# Altium project FuelCellMonitor.PrjPcb
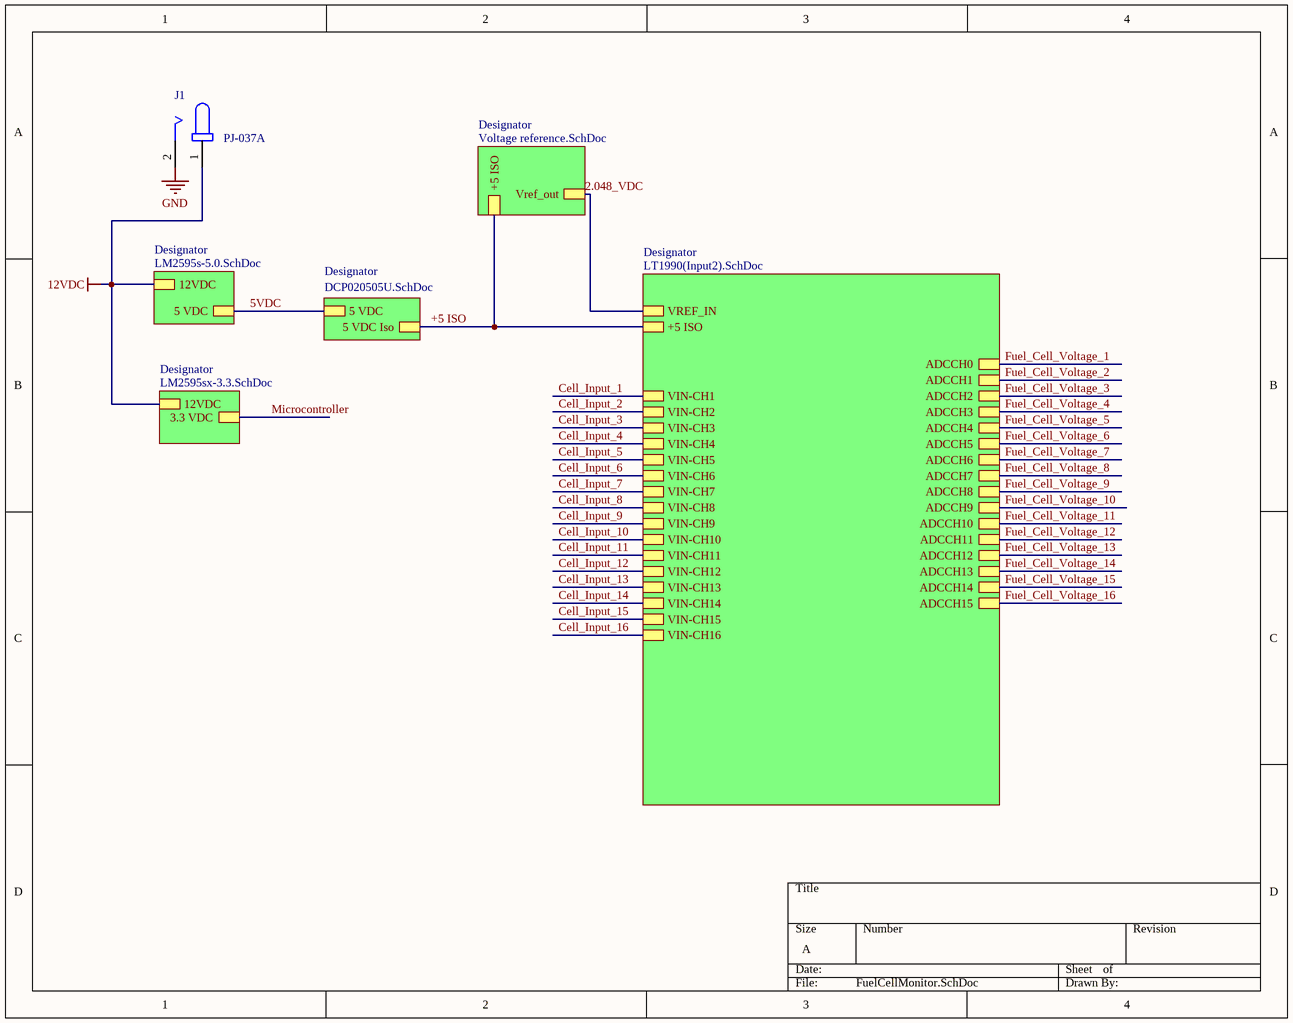
[diagram p0: FuelCellMonitor.SchDoc]
6 sheets, 108 parts. Net scope: hierarchical (ports join the sheet entries above them; power ports are global).
Board file: FuelCellMonitor.PcbDoc
Sheets:
  FuelCellMonitor.SchDoc
    Designator = LM2595s-5.0.SchDoc
    Designator = LM2595sx-3.3.SchDoc
    Designator = DCP020505U.SchDoc
    Designator = Voltage reference.SchDoc
    Designator = LT1990(Input2).SchDoc

## Sheet FuelCellMonitor.SchDoc
size A; SheetNumber: 1; SheetTotal: 6

### Parts
J1  PJ-037A  [CUI_PJ-037A]

### Sub-sheets
Designator = LM2595s-5.0.SchDoc: 12VDC, 5 VDC
Designator = LM2595sx-3.3.SchDoc: 12VDC, 3.3 VDC
Designator = DCP020505U.SchDoc: 5 VDC, 5 VDC Iso
Designator = Voltage reference.SchDoc: Vref_out, +5 ISO
Designator = LT1990(Input2).SchDoc: ADCCH1, ADCCH2, ADCCH3, ADCCH4, ADCCH5, ADCCH6, ADCCH7, ADCCH8, ADCCH9, ADCCH10, ADCCH11, ADCCH12, ADCCH13, ADCCH14, ADCCH15, ADCCH0, VIN-CH3, VIN-CH4, VIN-CH5, VIN-CH6, VIN-CH8, VIN-CH9, VIN-CH10, VIN-CH11, VIN-CH12, VIN-CH13, VIN-CH14, VIN-CH15, VIN-CH16, VIN-CH2, VIN-CH1, VIN-CH7, VREF_IN, +5 ISO

### Nets
12VDC: J1.1 ; sheet Designator/12VDC, sheet Designator/12VDC
+5 ISO: sheet Designator/5 VDC Iso, sheet Designator/+5 ISO, sheet Designator/+5 ISO
GND: J1.2
2.048_VDC: sheet Designator/Vref_out, sheet Designator/VREF_IN
5VDC: sheet Designator/5 VDC, sheet Designator/5 VDC

### Library data of the parts
J1 = PJ-037A: 2.0 mm Center Pin, 2.5 A, Right Angle, Through Hole, Dc Power Jack Connector; Value: *; Price: None; MP: PJ-037A; Availability: Unavailable; Package: None

## Sheet LM2595s-5.0.SchDoc
size A; SheetNumber: 2; SheetTotal: 6; SPICEModelCacheCJDLJAOA: <root> / <DocumentId>CJDLJAOA</DocumentId> / </root>
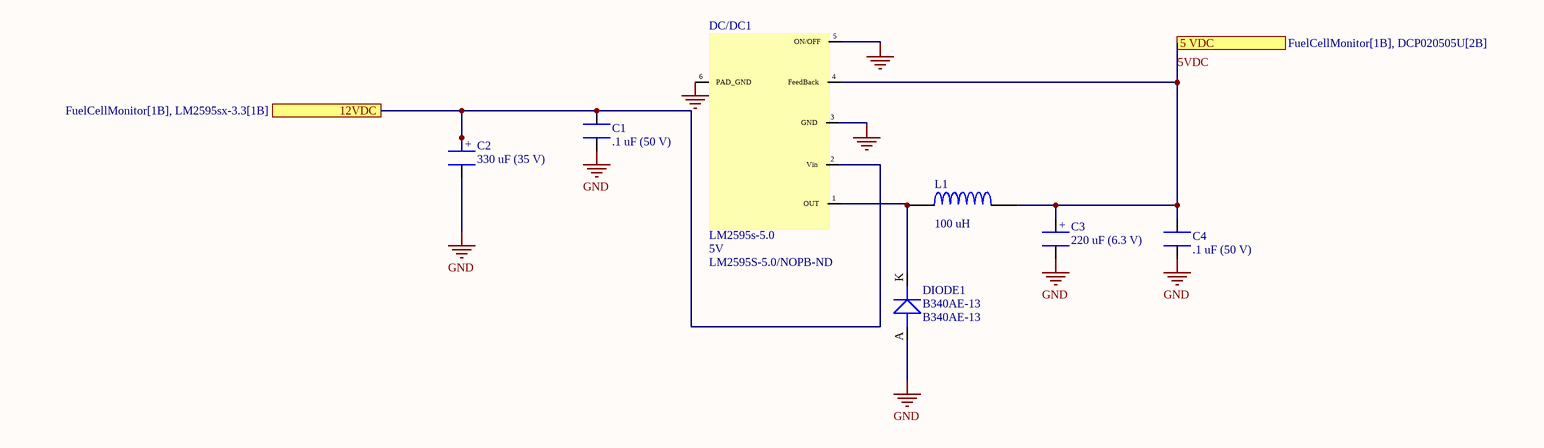
[diagram p1: LM2595s-5.0.SchDoc]

### Parts
C1  .1 uF (50 V)  [.1uF capacitor]
C2  330 uF (35 V)  [330uf cap]
C3  220 uF (6.3 V)  [220 uf cap]
C4  .1 uF (50 V)  [.1uF capacitor]
DC/DC1  LM2595s-5.0  Output Voltage: 5V  Supplier Part Number 1: LM2595S-5.0/NOPB-ND  [LM2595s-5.0]
DIODE1  B340AE-13  [B340AE-13]
L1  100 uH  [100uH inductor]

### Ports
5 VDC (see FuelCellMonitor[1B], DCP020505U[2B]), 12VDC (see FuelCellMonitor[1B], LM2595sx-3.3[1B])

### Nets
12VDC: C1.2 C2.1 DC/DC1.2(Vin) ; port 12VDC
GND: C1.1 C2.2 C3.2 C4.1 DC/DC1.3(GND) DC/DC1.5(ON/OFF) DC/DC1.6(PAD_GND) DIODE1.A
5VDC: C3.1 C4.2 DC/DC1.4(FeedBack) L1.2 ; port 5 VDC
NetDC/DC1_1: DC/DC1.1(OUT) DIODE1.K L1.1

### Notes on the sheet
- (in symbol 220 uF capacitor) +
- (in symbol 330 uF cap) +

### Library data of the parts
C1 C4 = .1 uF cap
C2 = 330 uF cap
C3 = 220 uF capacitor
DC/DC1 = LM2595S-5.0/NOPB: SIMPLE SWITCHE Power Converter 150 KHz 1A Step-Down Voltage egulator 5-DDPAK/TO-263; Manufacturer: Texas Instruments; Number of Outputs: 1; Efficiency: 82%; Min Input Voltage: 4.5V; Max Input Voltage: 40V; Frequency: 150kHz; Switching Frequency: 173kHz; Quiescent Current: 5mA; Output Type: Fixed; Supplier 1: Digi-Key; Manufacturer Part Number: LM2595S-5.0/NOPB; RoHS: Yes; Category: Voltage Regulators - Switching; Mount: Surface Mount; Case/Package: TO-263; Number of Pins: 5; Weight: 0.25lb; Min Operating Temperature: -40°C; Max Operating Temperature: 125°C; Output Current: 1A; Package Quantity: 45; Packaging: Rail/Tube; Max Output Current: 1A; Max Supply Voltage: 40V; Min Supply Voltage: 4.5V; Nominal Output Voltage: 5V; Max Output Voltage: 5V; Termination: SMD/SMT; Length: 10.16mm; Width: 8.64mm; Height: 4.57mm; Radiation Hardening: No; Lead Free: Contains Lead; RoHS Compliant: Yes; REACH SVHC: No SVHC; ComponentLink1URL: https://datasheet.ciiva.com/14150/eanatsemico-schaltr-lm2595-en-14150687.pdf?src-supplier=Distrelec; ComponentLink1Description: https://datasheet.ciiva.com/14150/eanatsemico-schaltr-lm2595-en-14150687.pdf?src-supplier=Distrelec; ComponentLink2URL: https://datasheet.ciiva.com/15112/getdatasheetpartid-89913-15112836.pdf?src-supplier=Verical; ComponentLink2Description: https://datasheet.ciiva.com/15112/getdatasheetpartid-89913-15112836.pdf?src-supplier=Verical; ComponentLink3URL: https://datasheet.ciiva.com/25775/1771567-25775403.pdf?src-supplier=Farnell; ComponentLink3Description: https://datasheet.ciiva.com/25775/1771567-25775403.pdf?src-supplier=Farnell; ComponentLink4URL: https://datasheet.ciiva.com/22746/1771567-22746709.pdf?src-supplier=Element14; ComponentLink4Description: https://datasheet.ciiva.com/22746/1771567-22746709.pdf?src-supplier=Element14; ComponentLink5URL: https://datasheet.ciiva.com/3219/lm2595-3219977.pdf?src-supplier=Avnet; ComponentLink5Description: https://datasheet.ciiva.com/3219/lm2595-3219977.pdf?src-supplier=Avnet
DIODE1 = B340AE-13: Schottky Diode, DO-201, 40V, 3.00A; Manufacturer: STMicroelectronics; Max Surge Current: 80A; Average Rectified Current: 3A; Max Reverse Leakage Current: 2mA; Element Configuration: Single; Polarity: Standard; Forward Voltage: 950mV; Capacitance: 190pF; Supplier 1: Mouser; RoHS: Yes; Category: Rectifier Diodes; Stock 1: 125419; Pricing 1: 1=0.47000, 10=0.38600, 50=0.38600, 100=0.26300, 600=0.19700, 1000=0.19700, 1200=0.14700, 2400=0.12700, 9600=0.11900, 10000=0.11900 (USD); Mount: Through Hole; Case/Package: DO-201AD; Number of Pins: 2; Weight: 0.01lb; Min Operating Temperature: -65°C; Max Operating Temperature: 150°C; Package Quantity: 1; Packaging: Tape and Reel; Max Forward Surge Current (Ifsm): 80A; Voltage Rating (DC): 40V; Current Rating: 3A; Output Current: 3A; Max Reverse Voltage (DC): 40V; Series: -; Forward Current: 3A; Max Reverse Current: 2mA; Max Repetitive Reverse Voltage (Vrrm): 40V; Peak Non-Repetitive Surge Current: 80A; Length: 9.5mm; Width: 5.3mm; Height: 5.3mm; Radiation Hardening: No; Lead Free: Lead Free; RoHS Compliant: Yes; REACH SVHC: No SVHC; ComponentLink1URL: https://datasheet.ciiva.com/1177/1689683-1177129.pdf?src-supplier=Element14; ComponentLink1Description: https://datasheet.ciiva.com/1177/1689683-1177129.pdf?src-supplier=Element14; ComponentLink2URL: https://datasheet.ciiva.com/26339/168275-da-01-en-schottky-barrier-rectif-axial-1n5822-26339005.pdf?src-supplier=Conrad; ComponentLink2Description: https://datasheet.ciiva.com/26339/168275-da-01-en-schottky-barrier-rectif-axial-1n5822-26339005.pdf?src-supplier=Conrad; ComponentLink3URL: https://datasheet.ciiva.com/16303/cd00001626-16303311.pdf?src-supplier=Future+Electronics; ComponentLink3Description: https://datasheet.ciiva.com/16303/cd00001626-16303311.pdf?src-supplier=Future+Electronics; ComponentLink4URL: https://datasheet.ciiva.com/916/cd00001626-916051.pdf?src-supplier=Digi-Key; ComponentLink4Description: https://datasheet.ciiva.com/916/cd00001626-916051.pdf?src-supplier=Digi-Key; ComponentLink5URL: https://datasheet.ciiva.com/916/cd00001626-916050.pdf?src-supplier=Digi-Key; ComponentLink5Description: https://datasheet.ciiva.com/916/cd00001626-916050.pdf?src-supplier=Digi-Key; Supplier Part Number 1: 511-1N5822; Manufacturer Part Number: B340AE-13
L1 = 100 uH inductor

## Sheet LM2595sx-3.3.SchDoc
size A; SheetNumber: 3; SheetTotal: 6
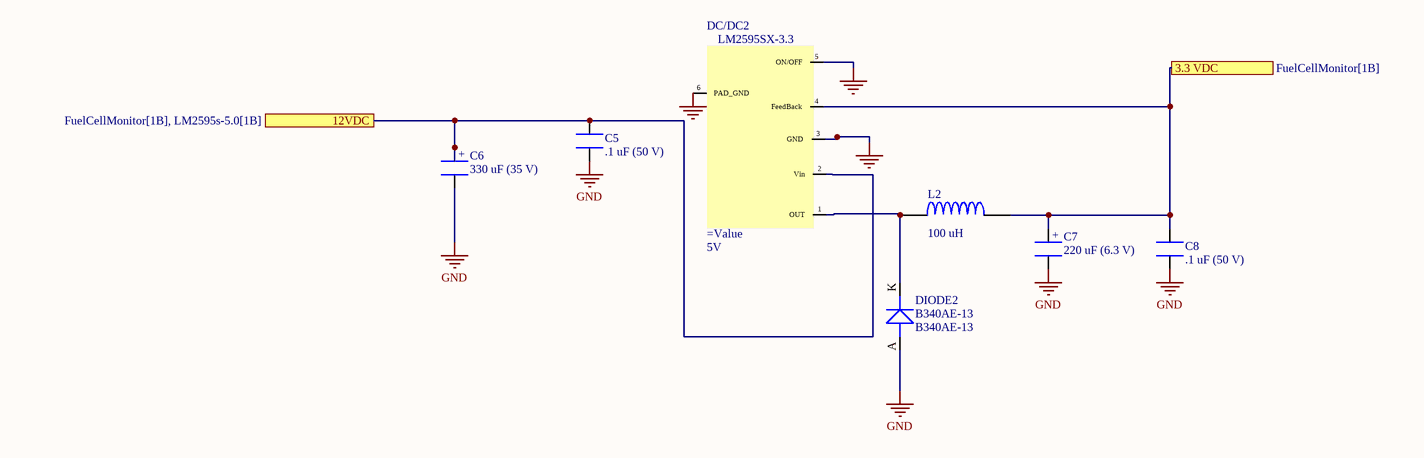
[diagram p2: LM2595sx-3.3.SchDoc]

### Parts
C5  .1 uF (50 V)  [.1uF capacitor]
C6  330 uF (35 V)  [330uf cap]
C7  220 uF (6.3 V)  [220 uf cap]
C8  .1 uF (50 V)  [.1uF capacitor]
DC/DC2  Output Voltage: 5V  [LM2595s-3.3]
DIODE2  B340AE-13  [B340AE-13]
L2  100 uH  [100uH inductor]

### Ports
3.3 VDC (see FuelCellMonitor[1B]), 12VDC (see FuelCellMonitor[1B], LM2595s-5.0[1B])

### Nets
12VDC: C5.2 C6.1 DC/DC2.2(Vin) ; port 12VDC
GND: C5.1 C6.2 C7.2 C8.1 DC/DC2.3(GND) DC/DC2.5(ON/OFF) DC/DC2.6(PAD_GND) DIODE2.A
Microcontroller: C7.1 C8.2 DC/DC2.4(FeedBack) L2.2 ; port 3.3 VDC
NetDC/DC2_1: DC/DC2.1(OUT) DIODE2.K L2.1

### Notes on the sheet
- (in symbol 220 uF capacitor) +
- (in symbol 330 uF cap) +
- (in symbol LM2595SX-3.3/NOPB_1) LM2595SX-3.3

### Library data of the parts
C5 C8 = .1 uF cap
C6 = 330 uF cap
C7 = 220 uF capacitor
DC/DC2 = LM2595SX-3.3/NOPB_1: SIMPLE SWITCHE Power Converter 150 KHz 1A Step-Down Voltage egulator 5-DDPAK/TO-263; Manufacturer: Texas Instruments; Manufacturer Part Number: LM2595S-5.0/NOPB; Number of Outputs: 1; Efficiency: 82%; Min Input Voltage: 4.5V; Max Input Voltage: 40V; Frequency: 150kHz; Switching Frequency: 173kHz; Quiescent Current: 5mA; Output Type: Fixed; Supplier 1: Digi-Key; RoHS: Yes; Category: Voltage Regulators - Switching; Mount: Surface Mount; Case/Package: TO-263; Number of Pins: 5; Weight: 0.25lb; Min Operating Temperature: -40°C; Max Operating Temperature: 125°C; Output Current: 1A; Package Quantity: 45; Packaging: Rail/Tube; Max Output Current: 1A; Max Supply Voltage: 40V; Min Supply Voltage: 4.5V; Nominal Output Voltage: 5V; Max Output Voltage: 5V; Termination: SMD/SMT; Length: 10.16mm; Width: 8.64mm; Height: 4.57mm; Radiation Hardening: No; Lead Free: Contains Lead; RoHS Compliant: Yes; REACH SVHC: No SVHC; ComponentLink1URL: https://datasheet.ciiva.com/14150/eanatsemico-schaltr-lm2595-en-14150687.pdf?src-supplier=Distrelec; ComponentLink1Description: https://datasheet.ciiva.com/14150/eanatsemico-schaltr-lm2595-en-14150687.pdf?src-supplier=Distrelec; ComponentLink2URL: https://datasheet.ciiva.com/15112/getdatasheetpartid-89913-15112836.pdf?src-supplier=Verical; ComponentLink2Description: https://datasheet.ciiva.com/15112/getdatasheetpartid-89913-15112836.pdf?src-supplier=Verical; ComponentLink3URL: https://datasheet.ciiva.com/25775/1771567-25775403.pdf?src-supplier=Farnell; ComponentLink3Description: https://datasheet.ciiva.com/25775/1771567-25775403.pdf?src-supplier=Farnell; ComponentLink4URL: https://datasheet.ciiva.com/22746/1771567-22746709.pdf?src-supplier=Element14; ComponentLink4Description: https://datasheet.ciiva.com/22746/1771567-22746709.pdf?src-supplier=Element14; ComponentLink5URL: https://datasheet.ciiva.com/3219/lm2595-3219977.pdf?src-supplier=Avnet; ComponentLink5Description: https://datasheet.ciiva.com/3219/lm2595-3219977.pdf?src-supplier=Avnet
DIODE2 = B340AE-13: as DIODE1 on sheet LM2595s-5.0; Supplier 1: Mouser; RoHS: Yes; Category: Rectifier Diodes; Stock 1: 125419; Pricing 1: 1=0.47000, 10=0.38600, 50=0.38600, 100=0.26300, 600=0.19700, 1000=0.19700, 1200=0.14700, 2400=0.12700, 9600=0.11900, 10000=0.11900 (USD); Mount: Through Hole; Case/Package: DO-201AD; Number of Pins: 2; Weight: 0.01lb; Min Operating Temperature: -65°C; Max Operating Temperature: 150°C; Package Quantity: 1; Packaging: Tape and Reel; Max Forward Surge Current (Ifsm): 80A; Voltage Rating (DC): 40V; Current Rating: 3A; Output Current: 3A; Max Reverse Voltage (DC): 40V; Series: -; Forward Current: 3A; Max Reverse Current: 2mA; Max Repetitive Reverse Voltage (Vrrm): 40V; Peak Non-Repetitive Surge Current: 80A; Length: 9.5mm; Width: 5.3mm; Height: 5.3mm; Radiation Hardening: No; Lead Free: Lead Free; RoHS Compliant: Yes; REACH SVHC: No SVHC; ComponentLink1URL: https://datasheet.ciiva.com/1177/1689683-1177129.pdf?src-supplier=Element14; ComponentLink1Description: https://datasheet.ciiva.com/1177/1689683-1177129.pdf?src-supplier=Element14; ComponentLink2URL: https://datasheet.ciiva.com/26339/168275-da-01-en-schottky-barrier-rectif-axial-1n5822-26339005.pdf?src-supplier=Conrad; ComponentLink2Description: https://datasheet.ciiva.com/26339/168275-da-01-en-schottky-barrier-rectif-axial-1n5822-26339005.pdf?src-supplier=Conrad; ComponentLink3URL: https://datasheet.ciiva.com/16303/cd00001626-16303311.pdf?src-supplier=Future+Electronics; ComponentLink3Description: https://datasheet.ciiva.com/16303/cd00001626-16303311.pdf?src-supplier=Future+Electronics; ComponentLink4URL: https://datasheet.ciiva.com/916/cd00001626-916051.pdf?src-supplier=Digi-Key; ComponentLink4Description: https://datasheet.ciiva.com/916/cd00001626-916051.pdf?src-supplier=Digi-Key; ComponentLink5URL: https://datasheet.ciiva.com/916/cd00001626-916050.pdf?src-supplier=Digi-Key; ComponentLink5Description: https://datasheet.ciiva.com/916/cd00001626-916050.pdf?src-supplier=Digi-Key; Supplier Part Number 1: 511-1N5822; Manufacturer Part Number: B340AE-13
L2 = 100 uH inductor

## Sheet DCP020505U.SchDoc
size A; SheetNumber: 4; SheetTotal: 6
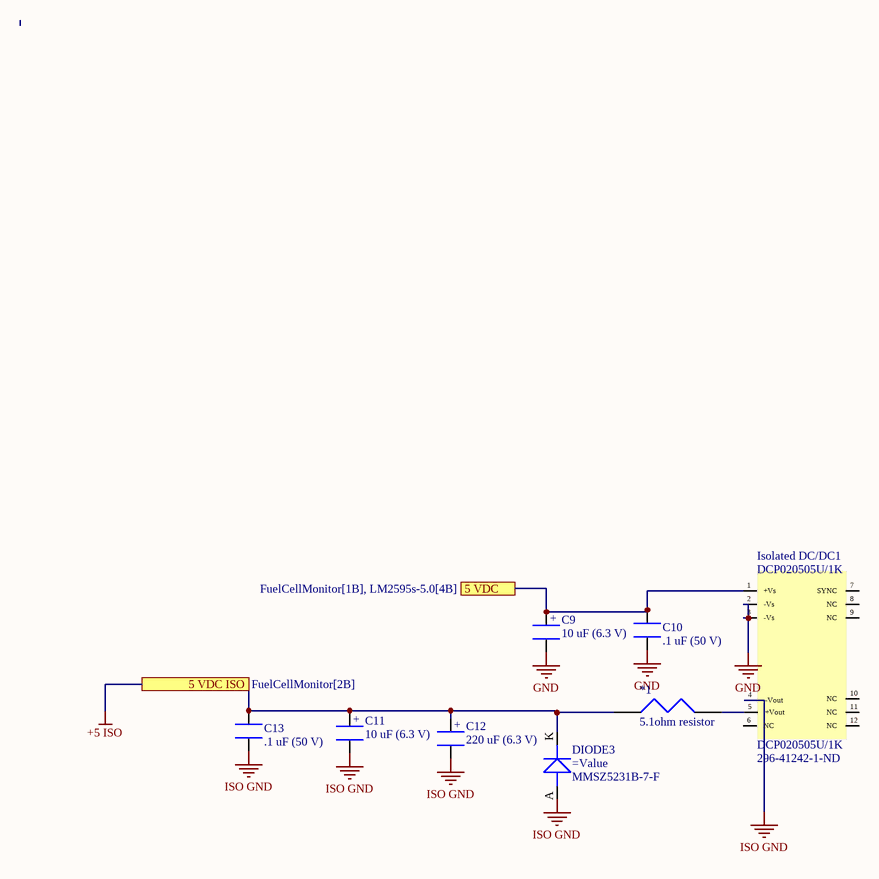
[diagram p3: DCP020505U.SchDoc]

### Parts
*1  5.1ohm resistor  [5.1 ohm resistor]
C9  10 uF (6.3 V)  [10 uF cap]
C10  .1 uF (50 V)  [.1uF capacitor]
C11  10 uF (6.3 V)  [10 uF cap]
C12  220 uF (6.3 V)  [220 uf cap]
C13  .1 uF (50 V)  [.1uF capacitor]
DIODE3  (no value)  [MMSZ5231B-7-F Zener diode]
Isolated_DC/DC1  DCP020505U/1K  Supplier Part Number 1: 296-41242-1-ND  [DCP020505U - duplicate]

### Ports
5 VDC (see FuelCellMonitor[1B], LM2595s-5.0[4B]), 5 VDC ISO (see FuelCellMonitor[2B])

### Nets
+5 ISO: *1.1 C11.1 C12.1 C13.2 DIODE3.K ; port 5 VDC ISO
GND: C9.2 C10.1 Isolated_DC/DC1.2(-Vs) Isolated_DC/DC1.3(-Vs)
ISO GND: C11.2 C12.2 C13.1 DIODE3.A Isolated_DC/DC1.4(-Vout)
5VDC: C9.1 C10.2 Isolated_DC/DC1.1(+Vs) ; port 5 VDC
Net*1_2: *1.2 Isolated_DC/DC1.5(+Vout)

Not connected (* = marked no-connect by the designer): Isolated_DC/DC1 6(NC) 7(SYNC) 8(NC) 9(NC) 10(NC) 11(NC) 12(NC)

### Notes on the sheet
- (in symbol 10 uF cap) +
- (in symbol 220 uF capacitor) +

### Library data of the parts
C9 C11 = 10 uF cap
C10 C13 = .1 uF cap
C12 = 220 uF capacitor
DIODE3 = MMSZ5231B-7-F: Zener diode; Manufacturer: STMicroelectronics; Max Surge Current: 80A; Average Rectified Current: 3A; Max Reverse Leakage Current: 2mA; Element Configuration: Single; Polarity: Standard; Voltage Rating (DC): 40V; Forward Voltage: 950mV; Capacitance: 190pF; Supplier 1: Mouser; RoHS: Yes; Category: Rectifier Diodes; Stock 1: 125419; Pricing 1: 1=0.47000, 10=0.38600, 50=0.38600, 100=0.26300, 600=0.19700, 1000=0.19700, 1200=0.14700, 2400=0.12700, 9600=0.11900, 10000=0.11900 (USD); Mount: Through Hole; Case/Package: DO-201AD; Number of Pins: 2; Weight: 0.01lb; Min Operating Temperature: -65°C; Max Operating Temperature: 150°C; Package Quantity: 1; Packaging: Tape and Reel; Max Forward Surge Current (Ifsm): 80A; Current Rating: 3A; Output Current: 3A; Max Reverse Voltage (DC): 40V; Series: -; Forward Current: 3A; Max Reverse Current: 2mA; Max Repetitive Reverse Voltage (Vrrm): 40V; Peak Non-Repetitive Surge Current: 80A; Length: 9.5mm; Width: 5.3mm; Height: 5.3mm; Radiation Hardening: No; Lead Free: Lead Free; RoHS Compliant: Yes; REACH SVHC: No SVHC; ComponentLink1URL: https://datasheet.ciiva.com/1177/1689683-1177129.pdf?src-supplier=Element14; ComponentLink1Description: https://datasheet.ciiva.com/1177/1689683-1177129.pdf?src-supplier=Element14; ComponentLink2URL: https://datasheet.ciiva.com/26339/168275-da-01-en-schottky-barrier-rectif-axial-1n5822-26339005.pdf?src-supplier=Conrad; ComponentLink2Description: https://datasheet.ciiva.com/26339/168275-da-01-en-schottky-barrier-rectif-axial-1n5822-26339005.pdf?src-supplier=Conrad; ComponentLink3URL: https://datasheet.ciiva.com/16303/cd00001626-16303311.pdf?src-supplier=Future+Electronics; ComponentLink3Description: https://datasheet.ciiva.com/16303/cd00001626-16303311.pdf?src-supplier=Future+Electronics; ComponentLink4URL: https://datasheet.ciiva.com/916/cd00001626-916051.pdf?src-supplier=Digi-Key; ComponentLink4Description: https://datasheet.ciiva.com/916/cd00001626-916051.pdf?src-supplier=Digi-Key; ComponentLink5URL: https://datasheet.ciiva.com/916/cd00001626-916050.pdf?src-supplier=Digi-Key; ComponentLink5Description: https://datasheet.ciiva.com/916/cd00001626-916050.pdf?src-supplier=Digi-Key; Supplier Part Number 1: 511-1N5822; Manufacturer Part Number: MMSZ5231B-7-F
Isolated_DC/DC1 = DCP020505U/1K: Miniature, 2W Isolated Unregulated DC/DC Converters 12-SOP -40 to 85; Manufacturer: Texas Instruments; Number of Outputs: 1; Efficiency: 80%; Max Output Current: 400mA; Max Input Voltage: 5.5V; Min Input Voltage: 4.5V; Voltage - Output 1: 5V; Isolation Voltage: 1kV; Max Power Dissipation: 90mW; Switching Frequency: 400kHz; Max Output Voltage: 5.25V; Min Output Voltage: 4.75V; Quiescent Current: 18mA; Output Type: Fixed; Supplier 1: Digi-Key; Manufacturer Part Number: DCP020505U/1K; RoHS: Yes; Category: Integrated Circuits (ICs); Case/Package: SOP; Number of Pins: 12; Min Operating Temperature: -40°C; Max Operating Temperature: 85°C; Packaging: Tape and Reel; Features: OTP; Package Quantity: 1000; Output Voltage: 5V; Output Current: 400mA; Output Power: 2W; Current - Output 1: 400mA; Max Output Power: 2W; Series: DCP02; Length: 0.71inch; Width: 0.3inch; Height: 0.1inch; Radiation Hardening: No; Lead Free: Lead Free; RoHS Compliant: Yes; ComponentLink1URL: https://datasheet.ciiva.com/2035/dcp020503-2035713.pdf?src-supplier=Digi-Key; ComponentLink1Description: https://datasheet.ciiva.com/2035/dcp020503-2035713.pdf?src-supplier=Digi-Key

## Sheet Voltage reference.SchDoc
size A; SheetNumber: 6; SheetTotal: 6
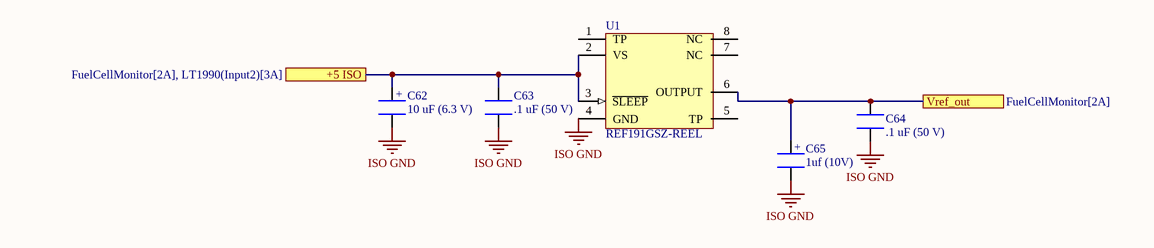
[diagram p4: Voltage reference.SchDoc]

### Parts
C62  10 uF (6.3 V)  [10 uF cap]
C63  .1 uF (50 V)  [.1uF capacitor]
C64  .1 uF (50 V)  [.1uF capacitor]
C65  1uf (10V)  [1 uF cap]
U1  REF191GSZ-REEL  [ADI-R-8_N]

### Ports
+5 ISO (see FuelCellMonitor[2A], LT1990(Input2)[3A]), Vref_out (see FuelCellMonitor[2A])

### Nets
+5 ISO: C62.1 C63.1 U1.2(VS) U1.3(~{SLEEP}) ; port +5 ISO
ISO GND: C62.2 C63.2 C64.1 C65.2 U1.4(GND)
2.048_VDC: C64.2 C65.1 U1.6(OUTPUT) ; port Vref_out

Not connected (* = marked no-connect by the designer): U1 1(TP) 5(TP) 7(NC) 8(NC)

### Notes on the sheet
- (in symbol 1uf cap) +
- (in symbol 10 uF cap) +

### Library data of the parts
C62 = 10 uF cap
C63 C64 = .1 uF cap
C65 = 1uf cap
U1 = REF191GSZ-REEL: Precision Micropower, Low Dropout Voltage Reference, 2.048 V Output, 2.3 to 15 V Supply, Industrial, 8-pin SOIC (R-8), Reel; Manufacturer: Analog Devices; Vout: 2.048V; Ref Out TC (ppm/C): 10; Mounting Technology: Surface Mount; ComponentLink3URL: http://www.analog.com/static/imported-files/packages/PKG_PDF/SOIC_Narrow%20(R)/R_8.pdf; PackageDescription: 8-Pin Standard Small Outline Package, Body 4.9 x 3.9 mm, Pitch 1.27 mm; PackageVersion: 060506-A, 06/2006; ComponentLink1Description: Manufacturer URL; Code_JEDEC: MS-012-AA; ComponentLink2URL: http://www.analog.com/static/imported-files/data_sheets/REF19xSeries.pdf; Operating Temp Range: -40 to 85 degC; PartNumber: REF191GSZ-REEL; Packing: Reel; ComponentLink3Description: Package Specification; ComponentLink4Description: URL Link1; PackageReference: R-8; ComponentLink1URL: http://www.analog.com/en/index.html; ComponentLink4URL: Product URL:http://www.analog.com/en/special-linear-functions/voltage-references/ref191/products/product.html; DatasheetVersion: Rev. L; ComponentLink2Description: Datasheet

## Sheet LT1990(Input2).SchDoc
size E; SheetNumber: 5; SheetTotal: 6
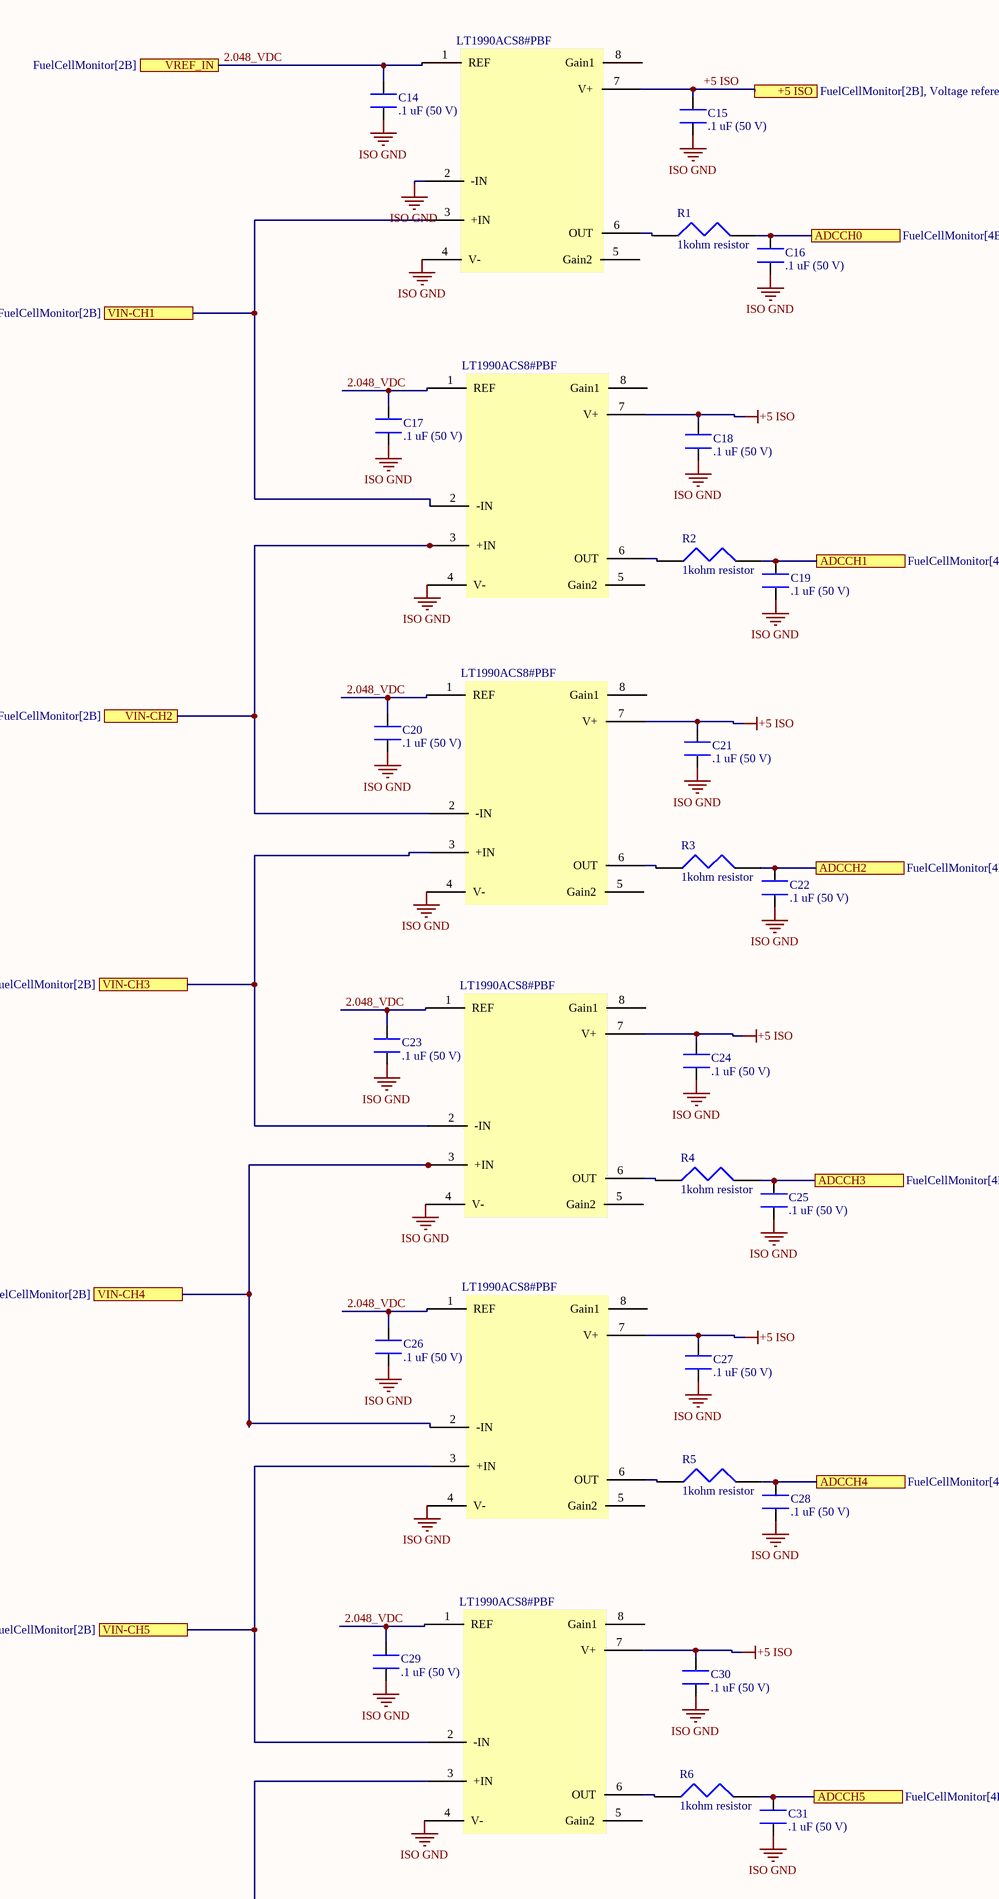
[diagram p5: LT1990(Input2).SchDoc, top left]
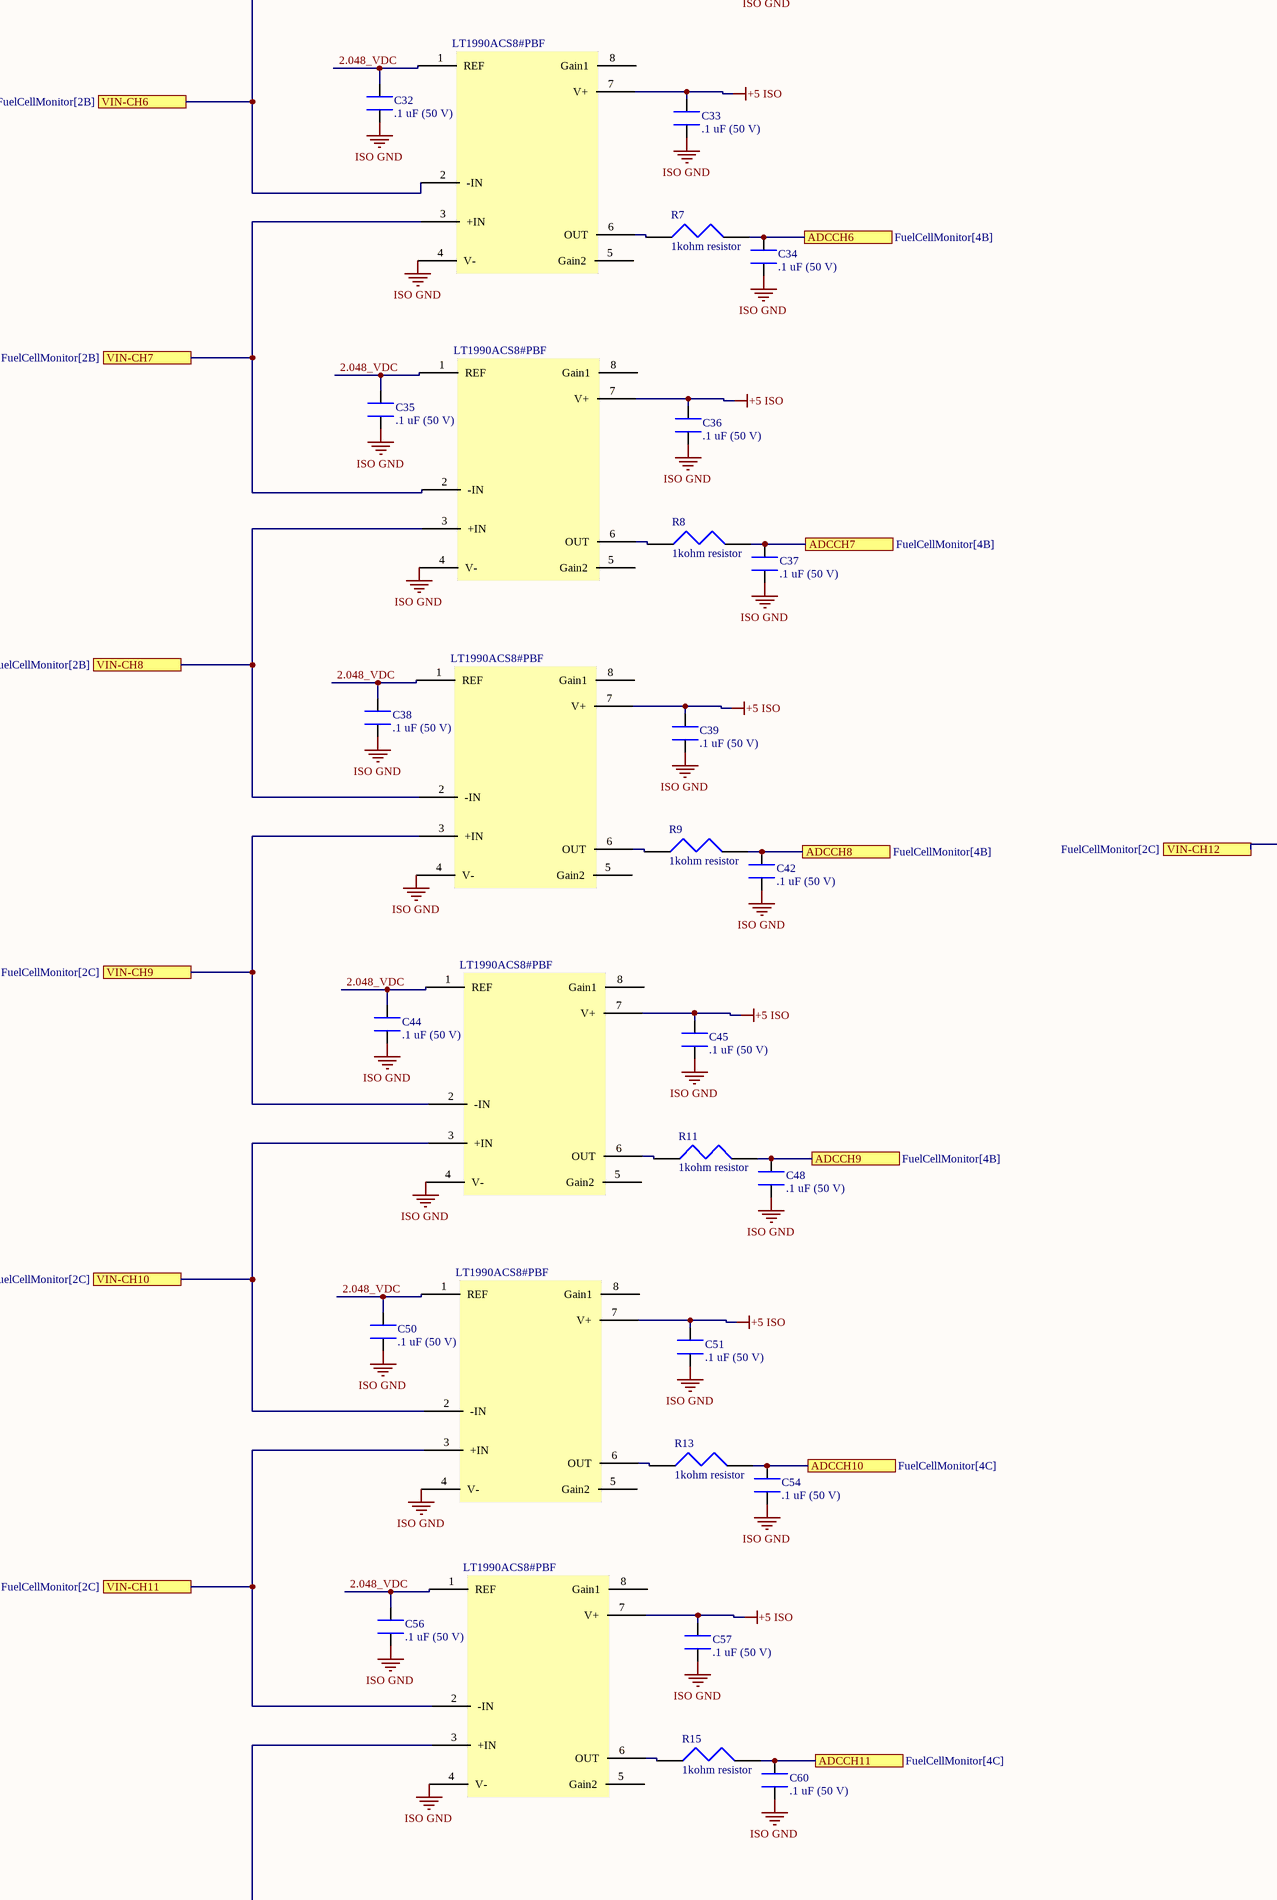
[diagram p6: LT1990(Input2).SchDoc, bottom left]
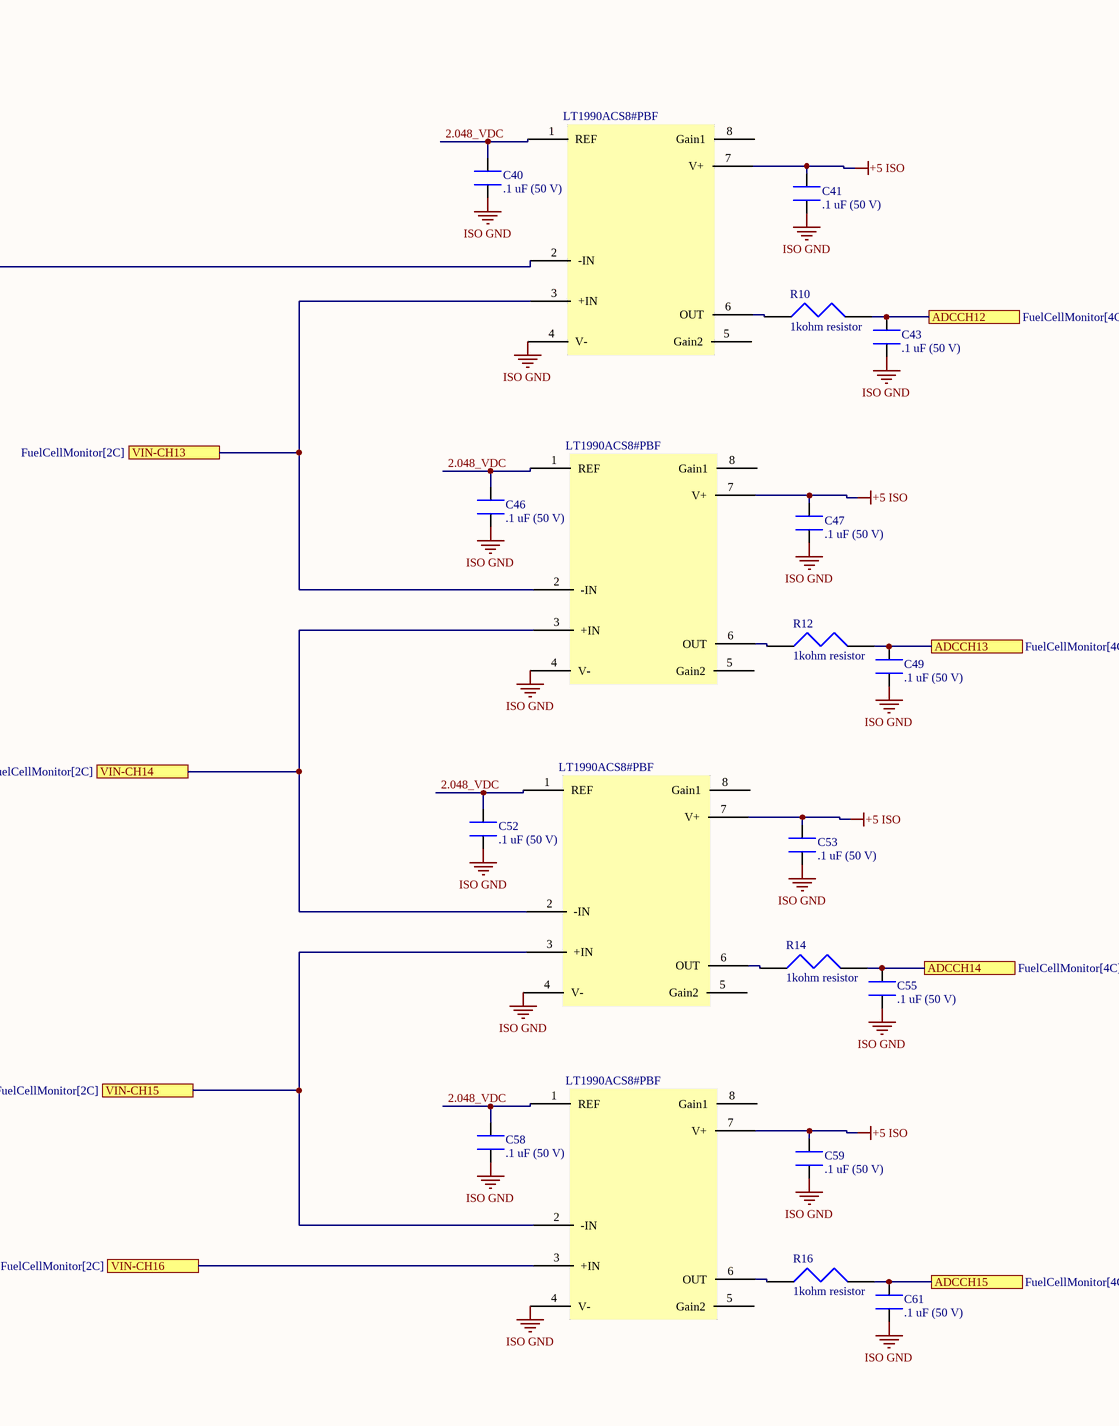
[diagram p7: LT1990(Input2).SchDoc, bottom right]

### Parts
C14  .1 uF (50 V)  [.1uF capacitor]
C15  .1 uF (50 V)  [.1uF capacitor]
C16  .1 uF (50 V)  [.1uF capacitor]
C17  .1 uF (50 V)  [.1uF capacitor]
C18  .1 uF (50 V)  [.1uF capacitor]
C19  .1 uF (50 V)  [.1uF capacitor]
C20  .1 uF (50 V)  [.1uF capacitor]
C21  .1 uF (50 V)  [.1uF capacitor]
C22  .1 uF (50 V)  [.1uF capacitor]
C23  .1 uF (50 V)  [.1uF capacitor]
C24  .1 uF (50 V)  [.1uF capacitor]
C25  .1 uF (50 V)  [.1uF capacitor]
C26  .1 uF (50 V)  [.1uF capacitor]
C27  .1 uF (50 V)  [.1uF capacitor]
C28  .1 uF (50 V)  [.1uF capacitor]
C29  .1 uF (50 V)  [.1uF capacitor]
C30  .1 uF (50 V)  [.1uF capacitor]
C31  .1 uF (50 V)  [.1uF capacitor]
C32  .1 uF (50 V)  [.1uF capacitor]
C33  .1 uF (50 V)  [.1uF capacitor]
C34  .1 uF (50 V)  [.1uF capacitor]
C35  .1 uF (50 V)  [.1uF capacitor]
C36  .1 uF (50 V)  [.1uF capacitor]
C37  .1 uF (50 V)  [.1uF capacitor]
C38  .1 uF (50 V)  [.1uF capacitor]
C39  .1 uF (50 V)  [.1uF capacitor]
C40  .1 uF (50 V)  [.1uF capacitor]
C41  .1 uF (50 V)  [.1uF capacitor]
C42  .1 uF (50 V)  [.1uF capacitor]
C43  .1 uF (50 V)  [.1uF capacitor]
C44  .1 uF (50 V)  [.1uF capacitor]
C45  .1 uF (50 V)  [.1uF capacitor]
C46  .1 uF (50 V)  [.1uF capacitor]
C47  .1 uF (50 V)  [.1uF capacitor]
C48  .1 uF (50 V)  [.1uF capacitor]
C49  .1 uF (50 V)  [.1uF capacitor]
C50  .1 uF (50 V)  [.1uF capacitor]
C51  .1 uF (50 V)  [.1uF capacitor]
C52  .1 uF (50 V)  [.1uF capacitor]
C53  .1 uF (50 V)  [.1uF capacitor]
C54  .1 uF (50 V)  [.1uF capacitor]
C55  .1 uF (50 V)  [.1uF capacitor]
C56  .1 uF (50 V)  [.1uF capacitor]
C57  .1 uF (50 V)  [.1uF capacitor]
C58  .1 uF (50 V)  [.1uF capacitor]
C59  .1 uF (50 V)  [.1uF capacitor]
C60  .1 uF (50 V)  [.1uF capacitor]
C61  .1 uF (50 V)  [.1uF capacitor]
LT1  LT1990  [LT1990ACS8]  (value not drawn)
LT2  LT1990  [LT1990ACS8]  (value not drawn)
LT3  LT1990  [LT1990ACS8]  (value not drawn)
LT4  LT1990  [LT1990ACS8]  (value not drawn)
LT5  LT1990  [LT1990ACS8]  (value not drawn)
LT6  LT1990  [LT1990ACS8]  (value not drawn)
LT7  LT1990  [LT1990ACS8]  (value not drawn)
LT8  LT1990  [LT1990ACS8]  (value not drawn)
LT9  LT1990  [LT1990ACS8]  (value not drawn)
LT10  LT1990  [LT1990ACS8]  (value not drawn)
LT11  LT1990  [LT1990ACS8]  (value not drawn)
LT12  LT1990  [LT1990ACS8]  (value not drawn)
LT13  LT1990  [LT1990ACS8]  (value not drawn)
LT14  LT1990  [LT1990ACS8]  (value not drawn)
LT15  LT1990  [LT1990ACS8]  (value not drawn)
LT16  LT1990  [LT1990ACS8]  (value not drawn)
R1  1kohm resistor  [1kohm resistor]
R2  1kohm resistor  [1kohm resistor]
R3  1kohm resistor  [1kohm resistor]
R4  1kohm resistor  [1kohm resistor]
R5  1kohm resistor  [1kohm resistor]
R6  1kohm resistor  [1kohm resistor]
R7  1kohm resistor  [1kohm resistor]
R8  1kohm resistor  [1kohm resistor]
R9  1kohm resistor  [1kohm resistor]
R10  1kohm resistor  [1kohm resistor]
R11  1kohm resistor  [1kohm resistor]
R12  1kohm resistor  [1kohm resistor]
R13  1kohm resistor  [1kohm resistor]
R14  1kohm resistor  [1kohm resistor]
R15  1kohm resistor  [1kohm resistor]
R16  1kohm resistor  [1kohm resistor]

### Ports
+5 ISO (see FuelCellMonitor[2B], Voltage reference[2B]), ADCCH0 (see FuelCellMonitor[4B]), ADCCH1 (see FuelCellMonitor[4B]), ADCCH2 (see FuelCellMonitor[4B]), ADCCH3 (see FuelCellMonitor[4B]), ADCCH4 (see FuelCellMonitor[4B]), ADCCH5 (see FuelCellMonitor[4B]), ADCCH6 (see FuelCellMonitor[4B]), ADCCH7 (see FuelCellMonitor[4B]), ADCCH8 (see FuelCellMonitor[4B]), ADCCH9 (see FuelCellMonitor[4B]), ADCCH10 (see FuelCellMonitor[4C]), ADCCH11 (see FuelCellMonitor[4C]), ADCCH12 (see FuelCellMonitor[4C]), ADCCH13 (see FuelCellMonitor[4C]), ADCCH14 (see FuelCellMonitor[4C]), ADCCH15 (see FuelCellMonitor[4C]), VIN-CH1 (see FuelCellMonitor[2B]), VIN-CH2 (see FuelCellMonitor[2B]), VIN-CH3 (see FuelCellMonitor[2B]), VIN-CH4 (see FuelCellMonitor[2B]), VIN-CH5 (see FuelCellMonitor[2B]), VIN-CH6 (see FuelCellMonitor[2B]), VIN-CH7 (see FuelCellMonitor[2B]), VIN-CH8 (see FuelCellMonitor[2B]), VIN-CH9 (see FuelCellMonitor[2C]), VIN-CH10 (see FuelCellMonitor[2C]), VIN-CH11 (see FuelCellMonitor[2C]), VIN-CH12 (see FuelCellMonitor[2C]), VIN-CH13 (see FuelCellMonitor[2C]), VIN-CH14 (see FuelCellMonitor[2C]), VIN-CH15 (see FuelCellMonitor[2C]), VIN-CH16 (see FuelCellMonitor[2C]), VREF_IN (see FuelCellMonitor[2B])

### Nets
+5 ISO: C15.2 C18.2 C21.2 C24.2 C27.2 C30.2 C33.2 C36.2 C39.2 C41.2 C45.2 C47.2 C51.2 C53.2 C57.2 C59.2 LT1.7(V+) LT2.7(V+) LT3.7(V+) LT4.7(V+) LT5.7(V+) LT6.7(V+) LT7.7(V+) LT8.7(V+) LT9.7(V+) LT10.7(V+) LT11.7(V+) LT12.7(V+) LT13.7(V+) LT14.7(V+) LT15.7(V+) LT16.7(V+) ; port +5 ISO
ISO GND: C14.1 C15.1 C16.1 C17.1 C18.1 C19.1 C20.1 C21.1 C22.1 C23.1 C24.1 C25.1 C26.1 C27.1 C28.1 C29.1 C30.1 C31.1 C32.1 C33.1 C34.1 C35.1 C36.1 C37.1 C38.1 C39.1 C40.1 C41.1 C42.1 C43.1 C44.1 C45.1 C46.1 C47.1 C48.1 C49.1 C50.1 C51.1 C52.1 C53.1 C54.1 C55.1 C56.1 C57.1 C58.1 C59.1 C60.1 C61.1 LT1.2(-IN) LT1.4(V-) LT2.4(V-) LT3.4(V-) LT4.4(V-) LT5.4(V-) LT6.4(V-) LT7.4(V-) LT8.4(V-) LT9.4(V-) LT10.4(V-) LT11.4(V-) LT12.4(V-) LT13.4(V-) LT14.4(V-) LT15.4(V-) LT16.4(V-)
2.048_VDC: C14.2 C17.2 C20.2 C23.2 C26.2 C29.2 C32.2 C35.2 C38.2 C40.2 C44.2 C46.2 C50.2 C52.2 C56.2 C58.2 LT1.1(REF) LT2.1(REF) LT3.1(REF) LT4.1(REF) LT5.1(REF) LT6.1(REF) LT7.1(REF) LT8.1(REF) LT9.1(REF) LT10.1(REF) LT11.1(REF) LT12.1(REF) LT13.1(REF) LT14.1(REF) LT15.1(REF) LT16.1(REF) ; port VREF_IN
Cell_Input_1: LT1.3(+IN) LT2.2(-IN) ; port VIN-CH1
Cell_Input_2: LT2.3(+IN) LT3.2(-IN) ; port VIN-CH2
Cell_Input_3: LT3.3(+IN) LT4.2(-IN) ; port VIN-CH3
Cell_Input_4: LT4.3(+IN) LT5.2(-IN) ; port VIN-CH4
Cell_Input_5: LT5.3(+IN) LT6.2(-IN) ; port VIN-CH5
Cell_Input_6: LT6.3(+IN) LT7.2(-IN) ; port VIN-CH6
Cell_Input_7: LT7.3(+IN) LT8.2(-IN) ; port VIN-CH7
Cell_Input_8: LT8.3(+IN) LT9.2(-IN) ; port VIN-CH8
Cell_Input_9: LT9.3(+IN) LT10.2(-IN) ; port VIN-CH9
Cell_Input_10: LT10.3(+IN) LT11.2(-IN) ; port VIN-CH10
Cell_Input_11: LT11.3(+IN) LT12.2(-IN) ; port VIN-CH11
Cell_Input_12: LT12.3(+IN) LT13.2(-IN) ; port VIN-CH12
Cell_Input_13: LT13.3(+IN) LT14.2(-IN) ; port VIN-CH13
Cell_Input_14: LT14.3(+IN) LT15.2(-IN) ; port VIN-CH14
Cell_Input_15: LT15.3(+IN) LT16.2(-IN) ; port VIN-CH15
Cell_Input_16: LT16.3(+IN) ; port VIN-CH16
Fuel_Cell_Voltage_1: C16.2 R1.2 ; port ADCCH0
Fuel_Cell_Voltage_2: C19.2 R2.2 ; port ADCCH1
Fuel_Cell_Voltage_3: C22.2 R3.2 ; port ADCCH2
Fuel_Cell_Voltage_4: C25.2 R4.2 ; port ADCCH3
Fuel_Cell_Voltage_5: C28.2 R5.2 ; port ADCCH4
Fuel_Cell_Voltage_6: C31.2 R6.2 ; port ADCCH5
Fuel_Cell_Voltage_7: C34.2 R7.2 ; port ADCCH6
Fuel_Cell_Voltage_8: C37.2 R8.2 ; port ADCCH7
Fuel_Cell_Voltage_9: C42.2 R9.2 ; port ADCCH8
Fuel_Cell_Voltage_10: C48.2 R11.2 ; port ADCCH9
Fuel_Cell_Voltage_11: C54.2 R13.2 ; port ADCCH10
Fuel_Cell_Voltage_12: C60.2 R15.2 ; port ADCCH11
Fuel_Cell_Voltage_13: C43.2 R10.2 ; port ADCCH12
Fuel_Cell_Voltage_14: C49.2 R12.2 ; port ADCCH13
Fuel_Cell_Voltage_15: C55.2 R14.2 ; port ADCCH14
Fuel_Cell_Voltage_16: C61.2 R16.2 ; port ADCCH15
NetLT1_6: LT1.6(OUT) R1.1
NetLT2_6: LT2.6(OUT) R2.1
NetLT3_6: LT3.6(OUT) R3.1
NetLT4_6: LT4.6(OUT) R4.1
NetLT5_6: LT5.6(OUT) R5.1
NetLT6_6: LT6.6(OUT) R6.1
NetLT7_6: LT7.6(OUT) R7.1
NetLT8_6: LT8.6(OUT) R8.1
NetLT9_6: LT9.6(OUT) R9.1
NetLT10_6: LT10.6(OUT) R11.1
NetLT11_6: LT11.6(OUT) R13.1
NetLT12_6: LT12.6(OUT) R15.1
NetLT13_6: LT13.6(OUT) R10.1
NetLT14_6: LT14.6(OUT) R12.1
NetLT15_6: LT15.6(OUT) R14.1
NetLT16_6: LT16.6(OUT) R16.1

Not connected (* = marked no-connect by the designer): LT1 5(Gain2) 8(Gain1); LT2 5(Gain2) 8(Gain1); LT3 5(Gain2) 8(Gain1); LT4 5(Gain2) 8(Gain1); LT5 5(Gain2) 8(Gain1); LT6 5(Gain2) 8(Gain1); LT7 5(Gain2) 8(Gain1); LT8 5(Gain2) 8(Gain1); LT9 5(Gain2) 8(Gain1); LT10 5(Gain2) 8(Gain1); LT11 5(Gain2) 8(Gain1); LT12 5(Gain2) 8(Gain1); LT13 5(Gain2) 8(Gain1); LT14 5(Gain2) 8(Gain1); LT15 5(Gain2) 8(Gain1); LT16 5(Gain2) 8(Gain1)

### Notes on the sheet
- (in symbol LT1990) LT1990ACS8#PBF

### Library data of the parts
C14-C61 = .1 uF cap

## Nets that join several sheets
12VDC: FuelCellMonitor (J1.1), LM2595s-5.0 (C1.2 C2.1 DC/DC1.2), LM2595sx-3.3 (C5.2 C6.1 DC/DC2.2)
+5 ISO: DCP020505U (5 pins), Voltage reference (C62.1 C63.1 U1.2 U1.3), LT1990(Input2) (32 pins)
GND: FuelCellMonitor (J1.2), LM2595s-5.0 (8 pins), LM2595sx-3.3 (8 pins), DCP020505U (C9.2 C10.1 Isolated_DC/DC1.2 Isolated_DC/DC1.3)
ISO GND: DCP020505U (5 pins), Voltage reference (5 pins), LT1990(Input2) (65 pins)
2.048_VDC: Voltage reference (C64.2 C65.1 U1.6), LT1990(Input2) (32 pins)
5VDC: LM2595s-5.0 (C3.1 C4.2 DC/DC1.4 L1.2), DCP020505U (C9.1 C10.2 Isolated_DC/DC1.1)